# Altium schematic sheet Sheet1.SchDoc
size A4
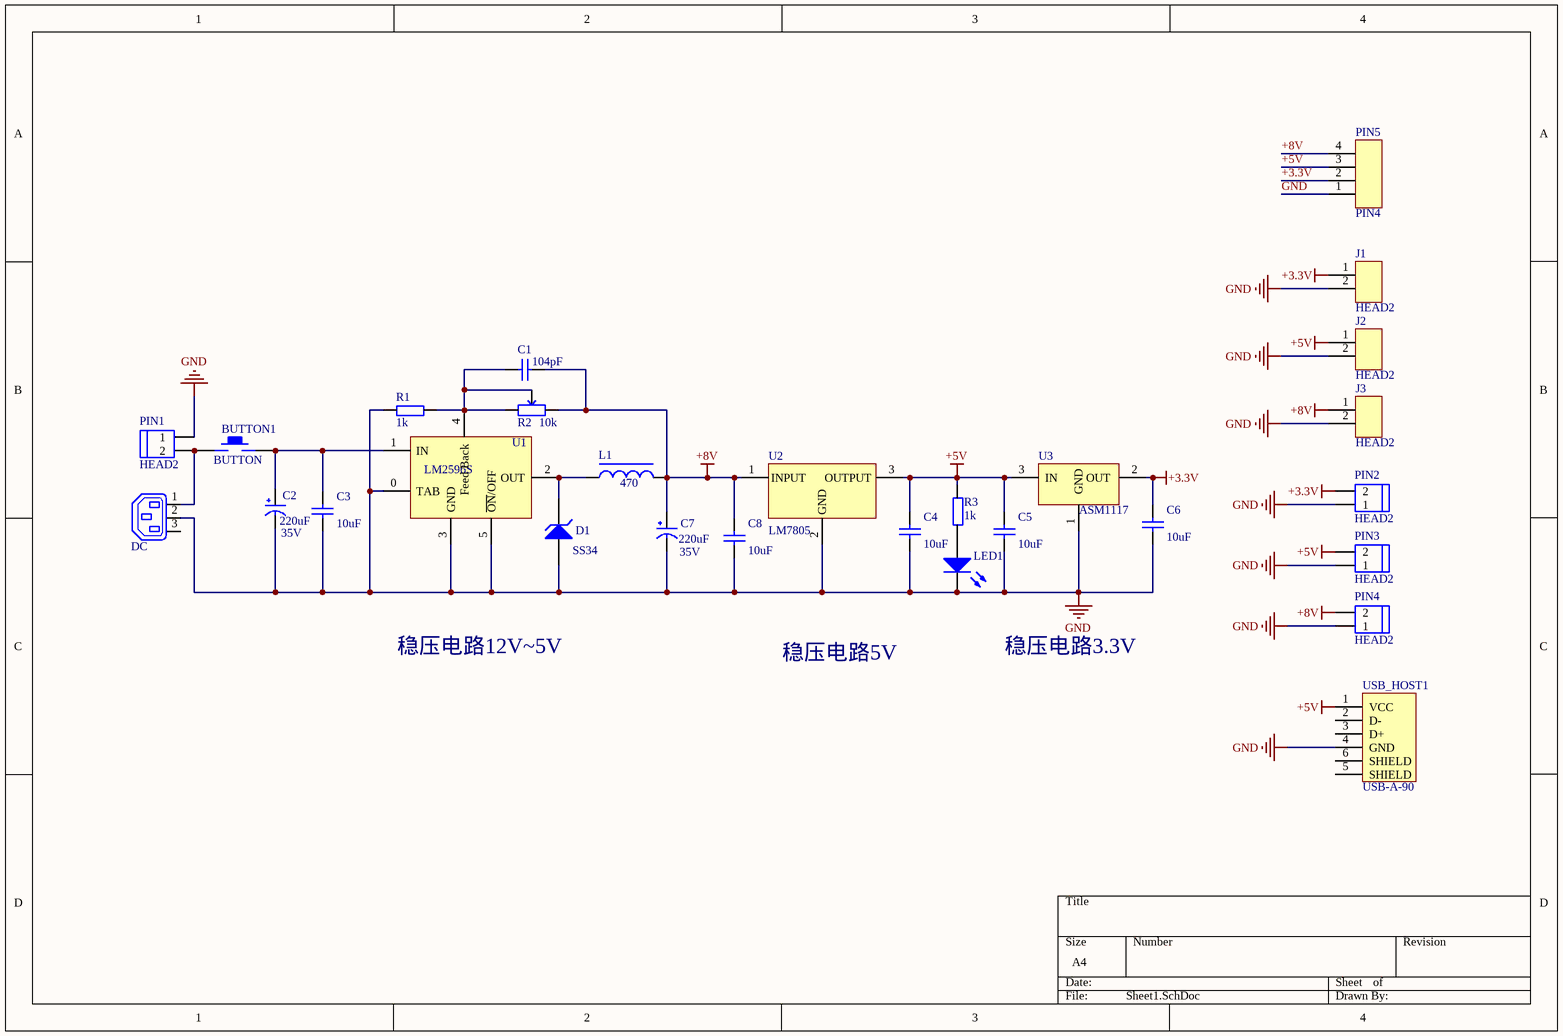
[diagram p0: Sheet1.SchDoc]

## Parts
BUTTON1  BUTTON  [BOUTTON]
C1  value 104pF  [C-0805]  (hidden comment: C_0805)
C2  220uF  Voltage: 35V  [8mm CAP+]
C3  value 10uF  [C-0805]  (hidden comment: C_0805)
C4  value 10uF  [C-0805]  (hidden comment: C_0805)
C5  value 10uF  [C-0805]  (hidden comment: C_0805)
C6  value 10uF  [C-0805]  (hidden comment: C_0805)
C7  220uF  Voltage: 35V  [8mm CAP+]
C8  value 10uF  [C-0805]  (hidden comment: C_0805)
D1  SS34  [Diode-SS14]
DC1  DC  [DC-DC接口]
J1  HEAD2  [HEARD2]
J2  HEAD2  [HEARD2]
J3  HEAD2  [HEARD2]
L1  value 470  [L]  (hidden comment: Inductor)
LED1  LED_0805  [LED-0805]  (value not drawn)
PIN1  HEAD2  [2PIN]
PIN2  HEAD2  [2PIN]
PIN3  HEAD2  [2PIN]
PIN4  HEAD2  [2PIN]
PIN5  PIN4  [HDR4]
R1  value 1k  [R-0805]  (hidden comment: 0805)
R2  value 10k  [RESPACK]  (hidden comment: Slide rheostat)
R3  value 1k  [R-0805]  (hidden comment: 0805)
U1  LM2596S  [LM2596S]
U2  LM7805  [LM7805]
U3  ASM1117  [ASM1117]
USB_HOST1  USB-A-90  [USB-A-90]

## Nets
+3.3V: C6.2 J1.1 PIN2.2 PIN5.2 U3.2(OUT)
+5V: C4.2 C5.2 J2.1 PIN3.2 PIN5.3 R3.2 U2.3(OUTPUT) U3.3(IN) USB_HOST1.1(VCC)
+8V: C1.1 C7.1(VCC) C8.2 J3.1 L1.2 PIN4.2 PIN5.4 R2.3 U2.1(INPUT)
GND: C2.2(GND) C3.1 C4.1 C5.1 C6.1 C7.2(GND) C8.1 D1.1(A) DC1.2(-) J1.2 J2.2 J3.2 LED1.2 PIN1.1 PIN2.1 PIN3.1 PIN4.1 PIN5.1 R1.1 U1.0(TAB) U1.3(GND) U1.5(~{ON}/OFF) U2.2(GND) U3.1(GND) USB_HOST1.4(GND)
NetBUTTON1_1: BUTTON1.1 DC1.1(+) PIN1.2
NetBUTTON1_2: BUTTON1.2 C2.1(VCC) C3.2 U1.1(IN)
NetC1_2: C1.2 R1.2 R2.1 R2.2 U1.4(Feed_Back)
NetD1_2: D1.2(K) L1.1 U1.2(OUT)
NetLED1_1: LED1.1 R3.1

Not connected (* = marked no-connect by the designer): DC1 3(-); USB_HOST1 2(D-) 3(D+) 5(SHIELD) 6(SHIELD)

## Notes on the sheet
- 稳压电路12V~5V
- 稳压电路3.3V
- 稳压电路5V

## Library data of the parts
BUTTON1 = BUTTON: 船式开关(KCD11 两档2脚)
C1 C3-C6 C8 = C_0805: 0805电容; Published: 8-Jun-2000; LatestRevisionDate: 17-Jul-2002; LatestRevisionNote: Re-released for DXP Platform.; PackageReference: RAD-0.3; Publisher: Altium Limited; PackageDescription: Radial Cap, Thru-Hole; 2 Leads; 0.3 in Pin Spacing
C2 C7 = CAP+  8MM_1: 电解电容 35V 220 uF (8*10.2)
D1 = D Zener: 稳压二极管 SS34（214A）; Published: 8-Jun-2000; LatestRevisionDate: 17-Jul-2002; LatestRevisionNote: Re-released for DXP Platform.; PackageReference: DIODE-0.7; Publisher: Altium Limited; PackageDescription: Diode, Thru-Hole; 2 Leads; 0.7 in Pin Spacing
DC1 = DC: DC 电源插座 (5.5-2.1)
J1-J3 = HEAD2: 2pin的连接键
L1 = L: Code_IEC: 1005; Published: 8-Jun-2000; LatestRevisionDate: 29-May-2009; LatestRevisionNote: IPC-7351 Footprint Added.; PackageReference: 0402-A; Publisher: Altium Limited; PackageDescription: Chip Inductor; Code_JEITA: 0402
LED1 = LED 0805: 0805-LED; Published: 8-Jun-2000; LatestRevisionDate: 08-Jul-2005; LatestRevisionNote: Mech Layer 1 removed.; PackageReference: LED-0; Publisher: Altium Limited; PackageDescription: LED; 2 Leads
PIN1 = HEAD2: 接线端子(KF301 2P)
R1 R3 = R_0805: 0805电阻
R2 = Slide rheostat: 3296W电位器
U1 = LM2596S_1: LM2596S稳压芯片
U2 = LM7805: LM7805三端稳压芯片
U3 = ASM1117: ASM1117三端稳压芯片
USB_HOST1 = USB_A_90_1